# Altium schematic sheet 16_SOLENOID_HB_1.SchDoc
size 420 x 297 mm; SheetNumber: 16; SheetTotal: 27
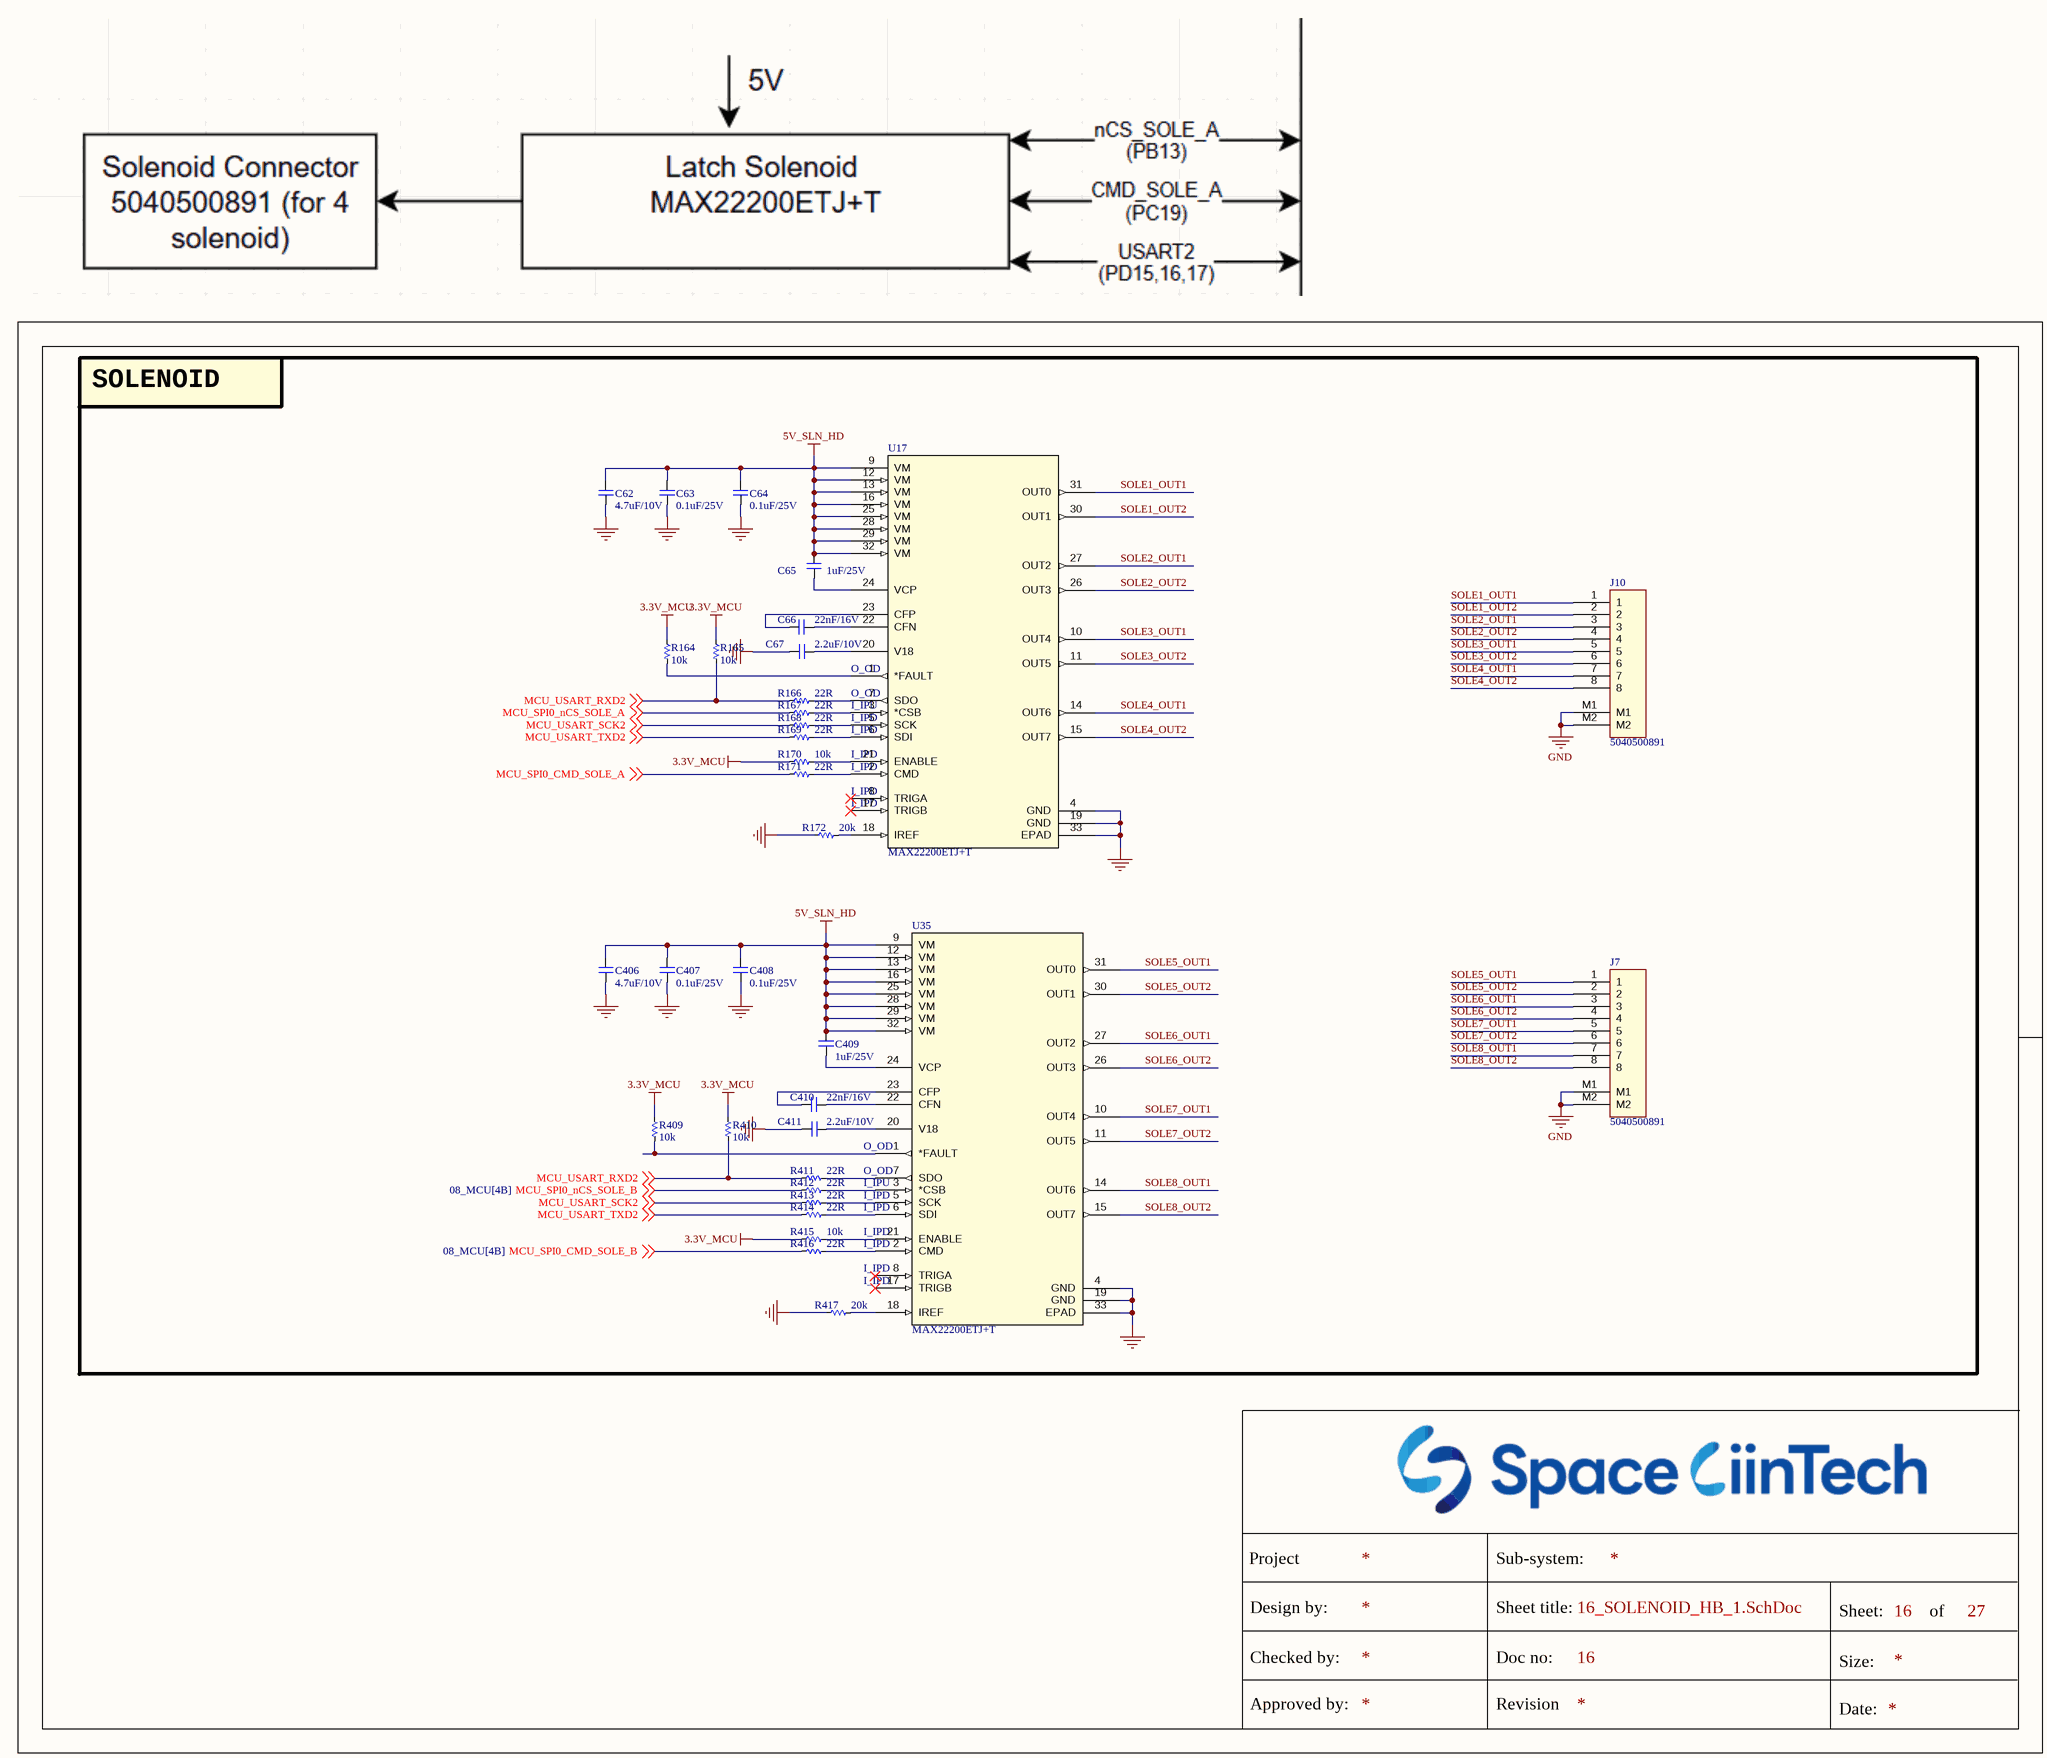
[diagram p0: 16_SOLENOID_HB_1.SchDoc]

## Parts
C62  4.7uF/10V  [CAP_C_1005X60]
C63  0.1uF/25V  [CAP_C_1005X60]
C64  0.1uF/25V  [CAP_C_1005X60]
C65  1uF/25V  [CAP_C_1005X60]
C66  22nF/16V  [CAP_C_1005X60]
C67  2.2uF/10V  [CAP_C_1005X60]
C406  4.7uF/10V  [CAP_C_1005X60]
C407  0.1uF/25V  [CAP_C_1005X60]
C408  0.1uF/25V  [CAP_C_1005X60]
C409  1uF/25V  [CAP_C_1005X60]
C410  22nF/16V  [CAP_C_1005X60]
C411  2.2uF/10V  [CAP_C_1005X60]
J7  5040500891  [MOLEX_5040500891]
J10  5040500891  [MOLEX_5040500891]
R164  10k  [RES_C_1005X40]
R165  10k  [RES_C_1005X40]
R166  22R  [RES_C_1005X40]
R167  22R  [RES_C_1005X40]
R168  22R  [RES_C_1005X40]
R169  22R  [RES_C_1005X40]
R170  10k  [RES_C_1005X40]
R171  22R  [RES_C_1005X40]
R172  20k  [RES_C_1005X40]
R409  10k  [RES_C_1005X40]
R410  10k  [RES_C_1005X40]
R411  22R  [RES_C_1005X40]
R412  22R  [RES_C_1005X40]
R413  22R  [RES_C_1005X40]
R414  22R  [RES_C_1005X40]
R415  10k  [RES_C_1005X40]
R416  22R  [RES_C_1005X40]
R417  20k  [RES_C_1005X40]
U17  MAX22200ETJ+T  [21-0140AK_T3255_8C_MXM]
U35  MAX22200ETJ+T  [21-0140AK_T3255_8C_MXM]

## Nets
3.3V_MCU: R164.1 R165.1 R170.1 R409.1 R410.1 R415.1
5V_SLN_HD: C62.2 C63.2 C64.2 C65.2 C406.2 C407.2 C408.2 C409.2 U17.9(VM) U17.12(VM) U17.13(VM) U17.16(VM) U17.25(VM) U17.28(VM) U17.29(VM) U17.32(VM) U35.9(VM) U35.12(VM) U35.13(VM) U35.16(VM) U35.25(VM) U35.28(VM) U35.29(VM) U35.32(VM)
GND: C62.1 C63.1 C64.1 C67.1 C406.1 C407.1 C408.1 C411.1 J7.M1 J7.M2 J10.M1 J10.M2 R172.1 R417.1 U17.4(GND) U17.19(GND) U17.33(EPAD) U35.4(GND) U35.19(GND) U35.33(EPAD)
MCU_SPI0_CMD_SOLE_A: R171.1 ; off-sheet MCU_SPI0_CMD_SOLE_A
MCU_SPI0_CMD_SOLE_B: R416.1 ; off-sheet MCU_SPI0_CMD_SOLE_B
MCU_SPI0_nCS_SOLE_A: R167.1 ; off-sheet MCU_SPI0_nCS_SOLE_A
MCU_SPI0_nCS_SOLE_B: R412.1 ; off-sheet MCU_SPI0_nCS_SOLE_B
MCU_USART_RXD2: R165.2 R166.1 R410.2 R411.1 ; off-sheet MCU_USART_RXD2
MCU_USART_SCK2: R168.1 R413.1 ; off-sheet MCU_USART_SCK2
MCU_USART_TXD2: R169.1 R414.1 ; off-sheet MCU_USART_TXD2
SOLE1_OUT1: J10.1 U17.31(OUT0)
SOLE1_OUT2: J10.2 U17.30(OUT1)
SOLE2_OUT1: J10.3 U17.27(OUT2)
SOLE2_OUT2: J10.4 U17.26(OUT3)
SOLE3_OUT1: J10.5 U17.10(OUT4)
SOLE3_OUT2: J10.6 U17.11(OUT5)
SOLE4_OUT1: J10.7 U17.14(OUT6)
SOLE4_OUT2: J10.8 U17.15(OUT7)
SOLE5_OUT1: J7.1 U35.31(OUT0)
SOLE5_OUT2: J7.2 U35.30(OUT1)
SOLE6_OUT1: J7.3 U35.27(OUT2)
SOLE6_OUT2: J7.4 U35.26(OUT3)
SOLE7_OUT1: J7.5 U35.10(OUT4)
SOLE7_OUT2: J7.6 U35.11(OUT5)
SOLE8_OUT1: J7.7 U35.14(OUT6)
SOLE8_OUT2: J7.8 U35.15(OUT7)
NetC65_1: C65.1 U17.24(VCP)
NetC66_1: C66.1 U17.22(CFN)
NetC66_2: C66.2 U17.23(CFP)
NetC67_2: C67.2 U17.20(V18)
NetC409_1: C409.1 U35.24(VCP)
NetC410_1: C410.1 U35.22(CFN)
NetC410_2: C410.2 U35.23(CFP)
NetC411_2: C411.2 U35.20(V18)
NetR164_2: R164.2 U17.1(*FAULT)
NetR166_2: R166.2 U17.7(SDO)
NetR167_2: R167.2 U17.3(*CSB)
NetR168_2: R168.2 U17.5(SCK)
NetR169_2: R169.2 U17.6(SDI)
NetR170_2: R170.2 U17.21(ENABLE)
NetR171_2: R171.2 U17.2(CMD)
NetR172_2: R172.2 U17.18(IREF)
NetR409_2: R409.2 U35.1(*FAULT)
NetR411_2: R411.2 U35.7(SDO)
NetR412_2: R412.2 U35.3(*CSB)
NetR413_2: R413.2 U35.5(SCK)
NetR414_2: R414.2 U35.6(SDI)
NetR415_2: R415.2 U35.21(ENABLE)
NetR416_2: R416.2 U35.2(CMD)
NetR417_2: R417.2 U35.18(IREF)

Not connected (* = marked no-connect by the designer): U17 8(TRIGA)* 17(TRIGB)*; U35 8(TRIGA)* 17(TRIGB)*

## Notes on the sheet
- SOLENOID
- (near U17) O_OD
- (near U17) I_IPU
- (near U17) I_IPD
- (near U35) O_OD
- O_OD
- (near U35) I_IPU
- (near U35) I_IPD
- I_IPD
- Project
- Sub-system:
- Design by:
- Sheet title:
- Sheet:
- of
- Checked by:
- Approved by:
- Doc no:
- Revision
- Size:
- Date:

## Library data of the parts
C62-C65 C67 C406-C409 C411 = _CAP_C_2: CAP
C66 C410 = _CAP_C_2: CAP CHIP
J7 J10 = Header 8x1_2M
R164-R172 R409-R417 = _RES_B_2: RES
U17 U35 = MAX22200ETJ+T: 36V, 1A Octal Integrated Serial-Controlled Solenoid and Motor Driver; Manufacturer_Name: Analog Devices Inc; Copyright: Copyright (C) 2026 Ultra Librarian. All rights reserved.; Manufacturer_Part_Number: MAX22200ETJ+T; RefDes: RefDes; Type: Type